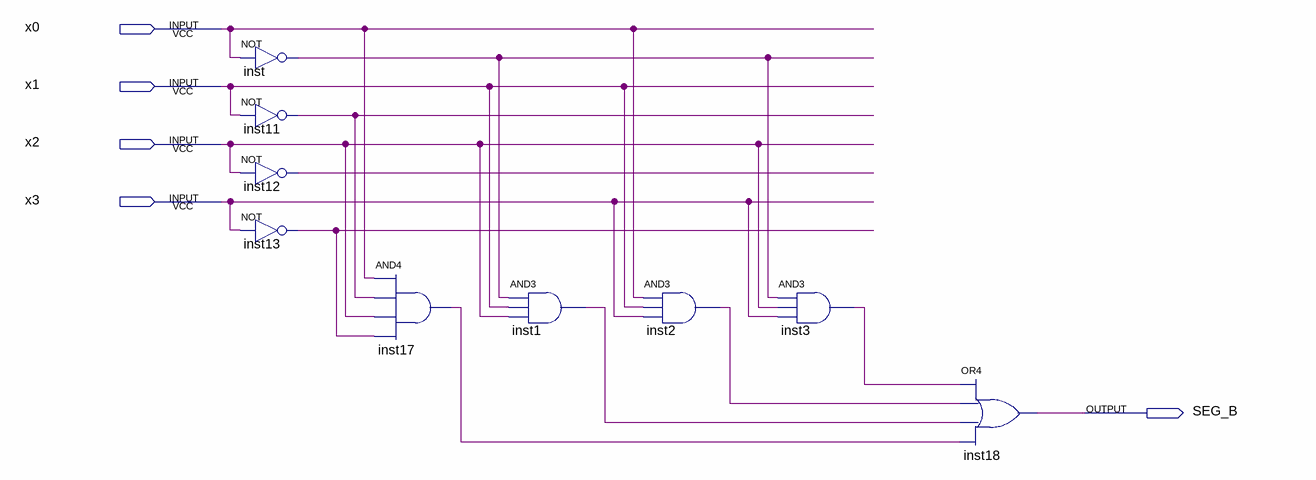
[diagram p0: schematic sheet]
// Quartus schematic SEG_B.bdf as structural Verilog: 9 symbols, 5 pins
module SEG_B (
  input  x0,
  input  x1,
  input  x2,
  input  x3,
  output SEG_B
);

  wire inst1_out, inst2_out, inst3_out, inst11_out, inst12_out, inst13_out, inst17_out, inst_out;

  not inst (inst_out, x0);
  not inst11 (inst11_out, x1);
  not inst12 (inst12_out, x2);
  not inst13 (inst13_out, x3);
  and inst17 (inst17_out, x0, inst11_out, x2, inst13_out);
  and inst1 (inst1_out, inst_out, x1, x2);
  and inst2 (inst2_out, x0, x1, x3);
  and inst3 (inst3_out, inst_out, x2, x3);
  or inst18 (SEG_B, inst3_out, inst2_out, inst1_out, inst17_out);
endmodule
